# Altium schematic sheet Tiny817_Xplained_Pro_current_measurement_calibration.SchDoc: Current measurement calibration
size A3; Organization: ATMEL Norway; Address1: Vestre Rosten 79; Address2: N-7075 TILLER; Address3: NORWAY; DocumentNumber: A09-2654; Revision: 8; SheetNumber: 8; SheetTotal: 9; PageSetup: Record=PageOptions|CenterHorizontal=True|CenterVertical=True|PrintScale=1.01|XCorrection=1.00|YCorrection=1.00|PrintKind=1|BorderSize=5000000|LeftOffset=0|BottomOffset=0|Orientation=2|PaperLength=1000|PaperWidth=1000|Scale=100|PaperSource=7|PrintQuality=-4|MediaType=1|DitherType=10|PaperKind=A3 (297 x 420 mm)|PrintScaleMode=1; ProjectTitle: Tiny817 Xplained Pro; PCBNumber: A08-2506; PCBRevision: 4
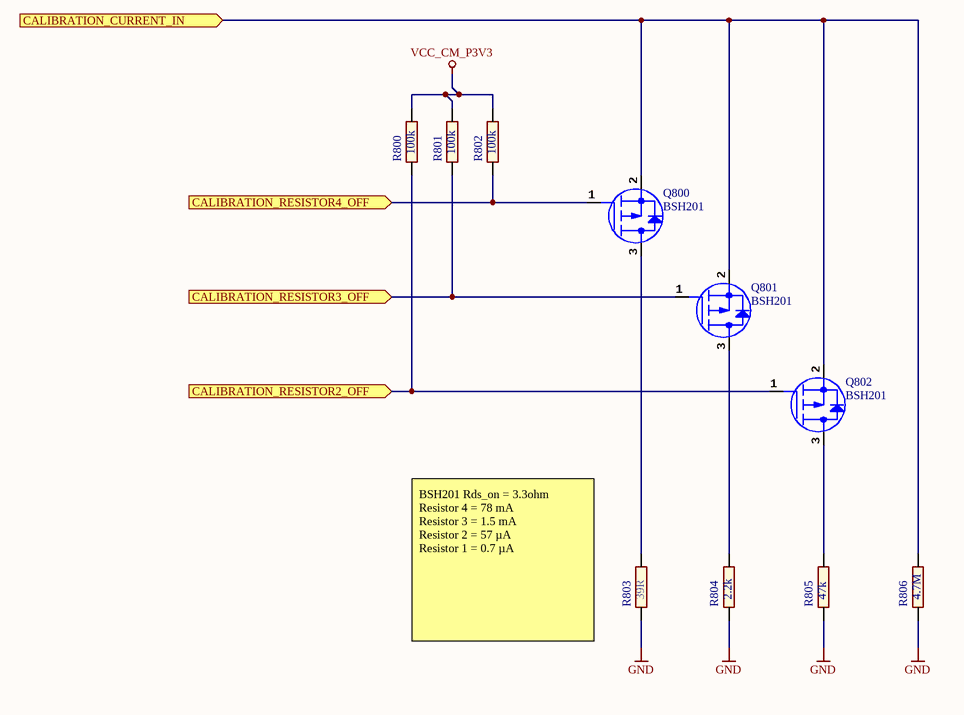
[diagram p0: Tiny817_Xplained_Pro_current_measurement_calibration.SchDoc]

## Parts
Q800  value BSH201  [AP5-00002]
Q801  value BSH201  [AP5-00002]
Q802  value BSH201  [AP5-00002]
R800  value 100k  [AP2-00011]
R801  value 100k  [AP2-00011]
R802  value 100k  [AP2-00011]
R803  value 39R  [AP2-00011]
R804  value 2.2k  [AP2-00011]
R805  value 47k  [AP2-00011]
R806  value 4.7M  [AP2-00011]

## Ports
CALIBRATION_CURRENT_IN (in), CALIBRATION_RESISTOR2_OFF (in), CALIBRATION_RESISTOR3_OFF (in), CALIBRATION_RESISTOR4_OFF (in)

## Nets
GND: R803.1 R804.1 R805.1 R806.1
VCC_CM_P3V3: R800.2 R801.2 R802.2
CALIBRATION_CURRENT_IN: Q800.2(S) Q801.2(S) Q802.2(S) R806.2 ; port CALIBRATION_CURRENT_IN
CALIBRATION_RESISTOR2_OFF: Q802.1(G) R800.1 ; port CALIBRATION_RESISTOR2_OFF
CALIBRATION_RESISTOR3_OFF: Q801.1(G) R801.1 ; port CALIBRATION_RESISTOR3_OFF
CALIBRATION_RESISTOR4_OFF: Q800.1(G) R802.1 ; port CALIBRATION_RESISTOR4_OFF
NetQ800_3: Q800.3(D) R803.2
NetQ801_3: Q801.3(D) R804.2
NetQ802_3: Q802.3(D) R805.2

## Notes on the sheet
- (near R803) BSH201 Rds_on = 3.3ohm
  Resistor 4 = 78 mA
  Resistor 3 = 1.5 mA
  Resistor 2 = 57 µA
  Resistor 1 = 0.7 µA
- Drawn By:
- Project Title
- Engineer:
- Designed with
- Sheet Title
- Size
- A3
- PCB Number:
- PCB Assembly Number:
- PCBA Revision:
- PCB    Revision:
- Date:
- Altium.com <http://go.altium.com/MicrochipLandingPage_Evaluation.html>
- File:
- Page:

## Library data of the parts
Q800-Q802 = A05-0132: P-Channel Digital FET. -60V, -0.3A continuous, -1.2A Peak. RDS(ON)=2.5@VGS=-10V, RDS(ON)=<5 ohm @VGS=-2.5V. VGS(th)<1.9V; PartGroup: Transistors,Small signal FET,SMD; Manufacturer: NXP; MPN: BSH201,215; AN: A05-0132
R800-R802 = A02-0260: Thick film resistor, SMD 0402, 1/16W, 1%; PartGroup: Resistors,SMD,0402 1%; Manufacturer: ASJ Holdings; MPN: CR10-1003-FK; TemperatureRange: -55ï¿½ to +125ï¿½C; AN: A02-0260; Tolerance: 1 %; Height: 0.349999994039536
R803 = A02-0178: Thick film resistor, SMD 0402, 1/16W, 1%; PartGroup: Resistors,SMD,0402 1%; Manufacturer: ASJ Holdings; MPN: CR10-39R0-FK; TemperatureRange: -55 - +125 deg C; AN: A02-0178; Tolerance: 1 %; Height: 0.349999994039536
R804 = A02-0220: Thick film resistor, SMD 0402, 1/16W, 1%; PartGroup: Resistors,SMD,0402 1%; Manufacturer: ASJ Holdings; MPN: CR10-2201-FK; TemperatureRange: -55 - +125 deg C; AN: A02-0220; Tolerance: 1 %; Height: 0.349999994039536
R805 = A02-0252: Thick film resistor, SMD 0402, 1/16W, 1%; PartGroup: Resistors,SMD,0402 1%; Manufacturer: KOA; MPN: RK73H1ETTP4702F; TemperatureRange: -55 - +125 deg C; AN: A02-0252; Tolerance: 1 %; Height: 0.349999994039536
R806 = A02-0884: Thick film SMD 0402 1/16W 1%; PartGroup: Resistors,SMD,0402 1%; Manufacturer: Yageo; MPN: RC0402FR-074M7L; TemperatureRange: -55 Â°C to +155 Â°C; AN: A02-0884; Tolerance: 1 %